# Altium schematic sheet Glove_PCB.SchDoc
size A; SheetNumber: 7; SheetTotal: 7
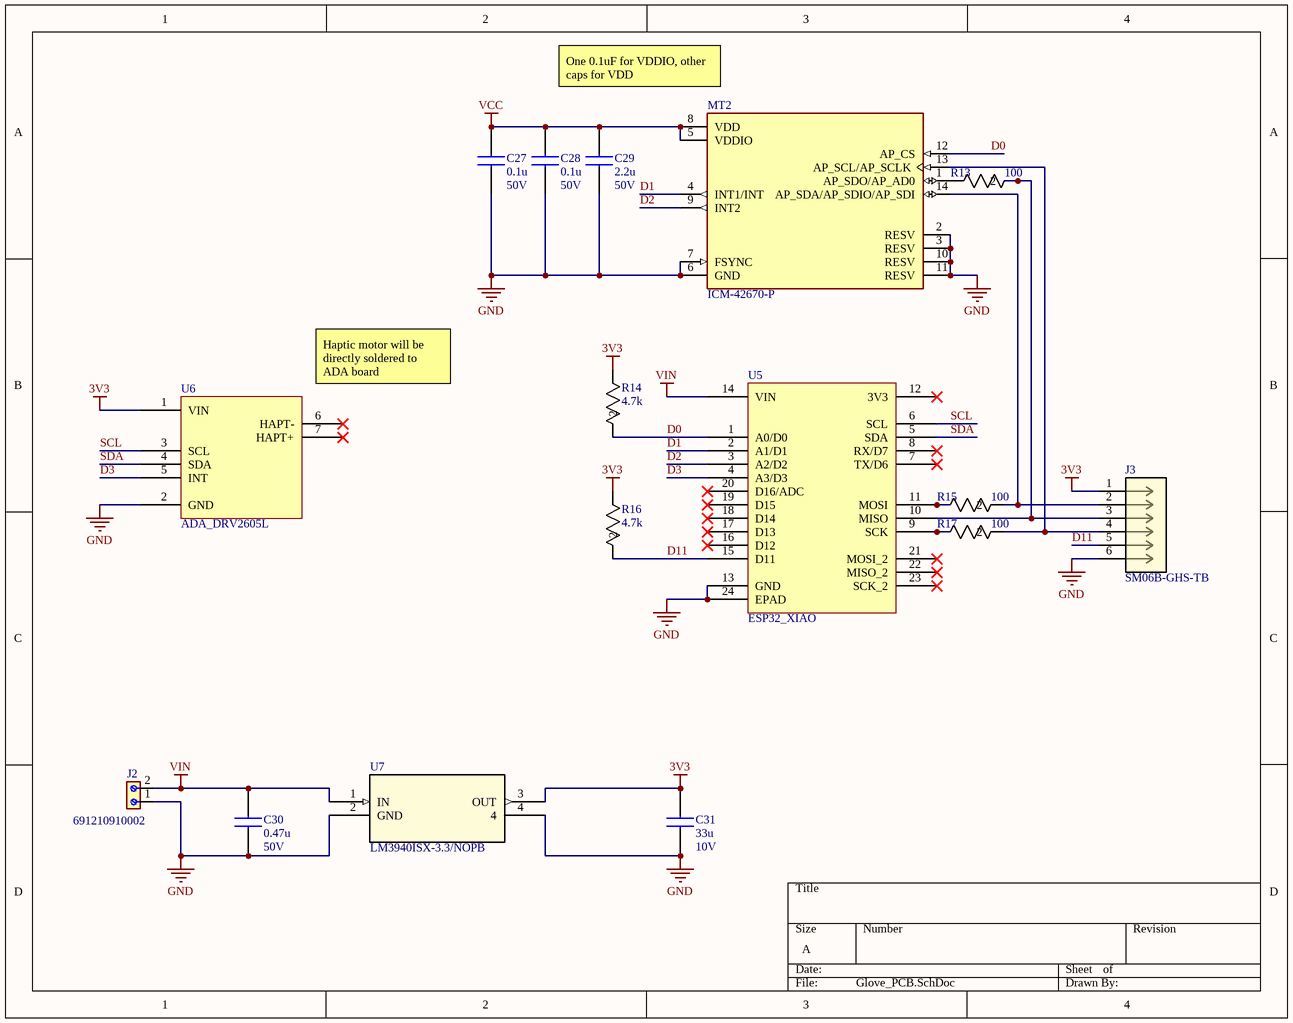
[diagram p0: Glove_PCB.SchDoc]

## Parts
C27  value 0.1u  Rated Voltage: 50V  [CAPC2012X145N]  (hidden comment: KAM21BR71H104JM)
C28  value 0.1u  Rated Voltage: 50V  [CAPC2012X145N]  (hidden comment: KAM21BR71H104JM)
C29  value 2.2u  Rated Voltage: 50V  [CAPC2012X145N]  (hidden comment: C2012X7R1H225K125AE)
C30  value 0.47u  Rated Voltage: 50V  [CAPC2012X145N]  (hidden comment: GCM21BR71H474KA55K)
C31  value 33u  Rated Voltage: 10V  [CAPC2012X145N]  (hidden comment: C2012X5R1A336M125AC)
J2  691210910002  [691210910002]
J3  SM06B-GHS-TB  [CONN_SM06B-GHS-TB_JST]
MT2  ICM-42670-P  [XDCR_ICM-42670-P]
R13  value 100  [RC0805N_YAG]  (hidden comment: RC0805JR-07100RL)
R14  value 4.7k  [RC0805N_YAG]  (hidden comment: RC0805JR-074K7L)
R15  value 100  [RC0805N_YAG]  (hidden comment: RC0805JR-07100RL)
R16  value 4.7k  [RC0805N_YAG]  (hidden comment: RC0805JR-074K7L)
R17  value 100  [RC0805N_YAG]  (hidden comment: RC0805JR-07100RL)
U5  ESP32_XIAO  [MOUDLE23P-SMD-2.54-21X17.8MM.kicad_mod.kicad_sym]
U6  ADA_DRV2605L  [ADA_DRV2605L]
U7  LM3940ISX-3.3/NOPB  [TS3B]

## Nets
3V3: C31.2 J3.1 R14.1 R16.1 U6.1(VIN) U7.3(OUT)
GND: C27.1 C28.1 C29.1 C30.1 C31.1 J2.1 J3.6 MT2.2(RESV) MT2.3(RESV) MT2.6(GND) MT2.7(FSYNC) MT2.10(RESV) MT2.11(RESV) U5.13(GND) U5.24(EPAD) U6.2(GND) U7.2(GND) U7.4
VCC: C27.2 C28.2 C29.2 MT2.5(VDDIO) MT2.8(VDD)
VIN: C30.2 J2.2 U5.14(VIN) U7.1(IN)
D0: MT2.12(AP_CS) R14.2 U5.1(A0/D0)
D1: MT2.4(INT1/INT) U5.2(A1/D1)
D2: MT2.9(INT2) U5.3(A2/D2)
D3: U5.4(A3/D3) U6.5(INT)
D11: J3.5 R16.2 U5.15(D11)
SCL: U5.6(SCL) U6.3(SCL)
SDA: U5.5(SDA) U6.4(SDA)
NetJ3_2: J3.2 MT2.14(AP_SDA/AP_SDIO/AP_SDI) R15.2
NetJ3_3: J3.3 R13.2 U5.10(MISO)
NetJ3_4: J3.4 MT2.13(AP_SCL/AP_SCLK) R17.2
NetMT2_1: MT2.1(AP_SDO/AP_AD0) R13.1
NetR15_1: R15.1 U5.11(MOSI)
NetR17_1: R17.1 U5.9(SCK)

Not connected (* = marked no-connect by the designer): U5 7(TX/D6)* 8(RX/D7)* 12(3V3)* 16(D12)* 17(D13)* 18(D14)* 19(D15)* 20(D16/ADC)* 21(MOSI_2)* 22(MISO_2)* 23(SCK_2)*; U6 6(HAPT-)* 7(HAPT+)*

## Notes on the sheet
- (near MT2) One 0.1uF for VDDIO, other caps for VDD
- (near U6) Haptic motor will be directly soldered to ADA board

## Library data of the parts
C27 C28 = KAM21BR71H104JM: Multilayer Ceramic Chip Capacitors, Capacitance=0.1u; Manufacturer_Part_Number: KAM21BR71H104JM
C29 = C2012X7R1H225K125AE: Multilayer Ceramic Chip Capacitors, Capacitance=2.2u; Manufacturer_Part_Number: C2012X7R1H225K125AE
C30 = GCM21BR71H474KA55K: Multilayer Ceramic Chip Capacitors, Capacitance=0.47u; Manufacturer_Part_Number: GCM21BR71H474KA55K
C31 = C2012X5R1A336M125AC: Multilayer Ceramic Chip Capacitors, Capacitance=33u; Manufacturer_Part_Number: C2012X5R1A336M125AC
J2 = 691210910002: MF: {'manufacturer': u'W\xfcrth Elektronik'}; Package: None; Price: None; Value: *; MP: 691210910002; Availability: Unavailable
J3 = SM06B-GHS-TB: No Description Available; Manufacturer_Name: JST; Copyright: Copyright (C) 2025 Ultra Librarian. All rights reserved.; Manufacturer_Part_Number: SM06B-GHS-TB; RefDes: RefDes; Type: Type
R13 R15 R17 = RC0805JR-07100RL: RES 0805 100 5% 1/8W; Manufacturer_Name: Yageo; Manufacturer_Part_Number: RC0805JR-07100RL; Tolerance: 5%
R14 R16 = RC0805JR-074K7L: RES 0805 4.7k 5% 1/8W; Manufacturer_Name: Yageo; Manufacturer_Part_Number: RC0805JR-074K7L; Tolerance: 5%
U7 = LM3940ISX-3.3NOPB: 1-A, low-dropout voltage regulator for 5-V to 3.3-V conversion 3-DDPAK/TO-263 -40 to 125; Manufacturer_Name: Texas Instruments; Type: LM3940IS-3.3; Copyright: Copyright (C) 2025 Ultra Librarian. All rights reserved.; Manufacturer_Part_Number: LM3940ISX-3.3/NOPB; Datasheet: https://www.ti.com/lit/gpn/lm3940; RefDes: RefDes
MT2 = ICM-42670-P: Package: None; Price: None; Value: *; MP: ICM-42670-P; Availability: Unavailable